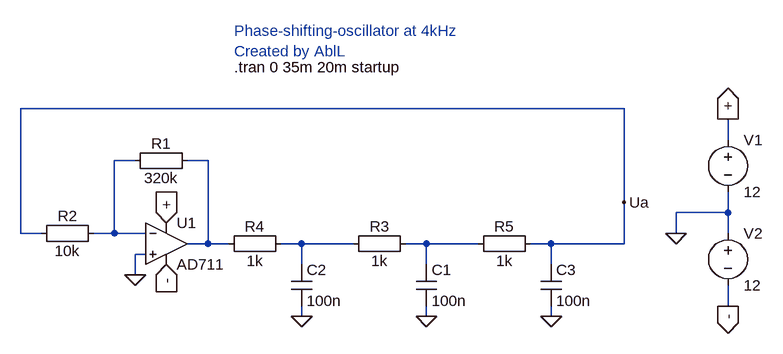
[diagram p0: schematic Phasenschieber-Oszillator.asc]
Phasenschieber-Oszillator.asc, the LTspice schematic file:
Version 4
SHEET 1 936 680
WIRE 704 -64 -224 -64
WIRE 864 -16 864 -48
WIRE -48 16 -80 16
WIRE 64 16 32 16
WIRE 704 80 704 -64
WIRE 864 96 864 64
WIRE 864 96 784 96
WIRE -224 128 -224 -64
WIRE -192 128 -224 128
WIRE -80 128 -80 16
WIRE -80 128 -112 128
WIRE -32 128 -80 128
WIRE 784 128 784 96
WIRE 864 128 864 96
WIRE 64 144 64 16
WIRE 64 144 32 144
WIRE 96 144 64 144
WIRE 208 144 176 144
WIRE 288 144 208 144
WIRE 400 144 368 144
WIRE 480 144 400 144
WIRE 592 144 560 144
WIRE 704 144 704 80
WIRE 704 144 592 144
WIRE -32 160 -48 160
WIRE 208 176 208 144
WIRE 400 176 400 144
WIRE 592 176 592 144
WIRE -48 192 -48 160
WIRE 864 240 864 208
WIRE 208 256 208 240
WIRE 400 256 400 240
WIRE 592 256 592 240
FLAG 0 112 +
IOPIN 0 112 In
FLAG 0 176 -
IOPIN 0 176 In
FLAG 864 -48 +
IOPIN 864 -48 Out
FLAG 864 240 -
IOPIN 864 240 Out
FLAG 784 128 0
FLAG 208 256 0
FLAG -48 192 0
FLAG 400 256 0
FLAG 592 256 0
FLAG 704 80 Ua
SYMBOL Misc\\EuropeanResistor 48 0 R90
WINDOW 0 5 56 VBottom 2
WINDOW 3 27 56 VTop 2
SYMATTR InstName R1
SYMATTR Value 320k
SYMBOL Misc\\EuropeanResistor -208 144 R270
WINDOW 0 27 56 VTop 2
WINDOW 3 5 56 VBottom 2
SYMATTR InstName R2
SYMATTR Value 10k
SYMBOL voltage 864 -32 R0
WINDOW 123 0 0 Left 0
WINDOW 39 0 0 Left 0
SYMATTR InstName V1
SYMATTR Value 12
SYMBOL voltage 864 112 R0
WINDOW 123 0 0 Left 0
WINDOW 39 0 0 Left 0
SYMATTR InstName V2
SYMATTR Value 12
SYMBOL Opamps\\AD711 0 80 R0
SYMATTR InstName U1
SYMBOL Misc\\EuropeanResistor 80 160 R270
WINDOW 0 27 56 VTop 2
WINDOW 3 5 56 VBottom 2
SYMATTR InstName R4
SYMATTR Value 1k
SYMBOL cap 192 176 R0
SYMATTR InstName C2
SYMATTR Value 100n
SYMBOL Misc\\EuropeanResistor 272 160 R270
WINDOW 0 27 56 VTop 2
WINDOW 3 5 56 VBottom 2
SYMATTR InstName R3
SYMATTR Value 1k
SYMBOL cap 384 176 R0
SYMATTR InstName C1
SYMATTR Value 100n
SYMBOL Misc\\EuropeanResistor 464 160 R270
WINDOW 0 27 56 VTop 2
WINDOW 3 5 56 VBottom 2
SYMATTR InstName R5
SYMATTR Value 1k
SYMBOL cap 576 176 R0
SYMATTR InstName C3
SYMATTR Value 100n
TEXT 104 -128 Left 2 !.tran 0 35m 20m startup
TEXT 104 -184 Left 2 ;Phase-shifting-oscillator at 4kHz\nCreated by AblL

The netlist it stands for:
* Phasenschieber-Oszillator.asc
R1 N002 N001 320k
R2 Ua N001 10k
V1 + 0 12
V2 0 - 12
XU1 0 N001 + - N002 AD712  ; AD711, pins In+ In- V+ V- OUT
R4 N002 N003 1k
C2 N003 0 100n
R3 N003 N004 1k
C1 N004 0 100n
R5 N004 Ua 1k
C3 Ua 0 100n
.tran 0 35m 20m startup
* Phase-shifting-oscillator at 4kHz
* Created by AblL
.lib ADI1.lib
.backanno
.end